# Altium project CCD_CAM_BOARD.PrjPcb (part 4 of 4)

## Sheet P6_CCD_CAM_BOARD_HDMI.SchDoc
size A4
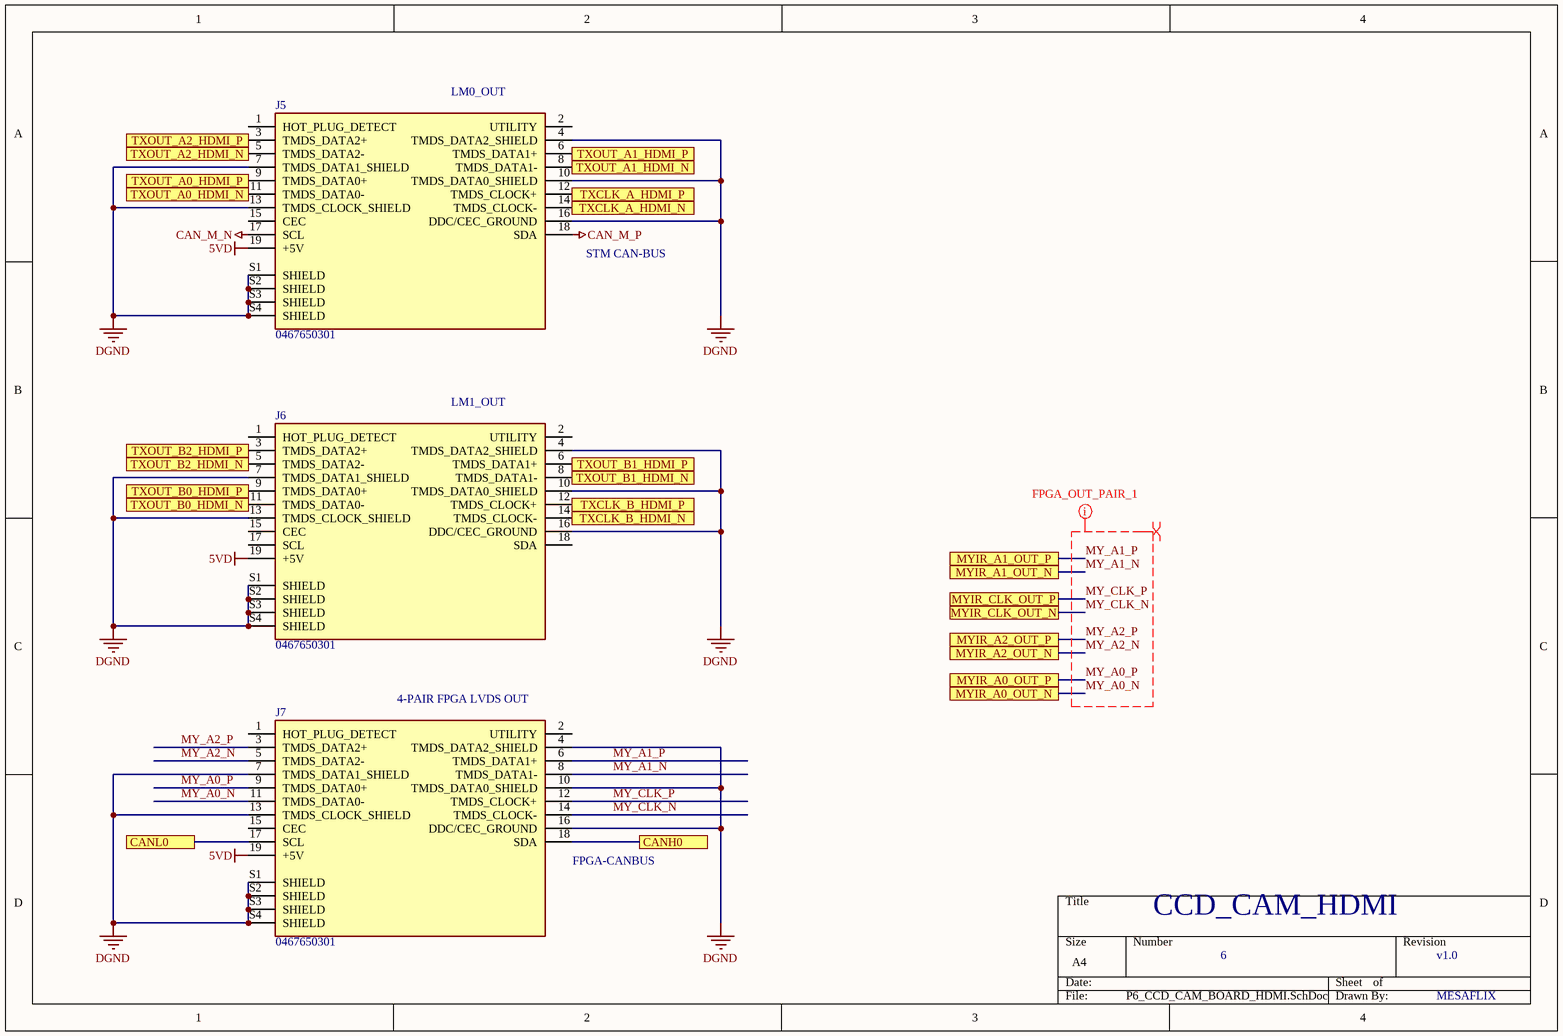
[diagram p5: P6_CCD_CAM_BOARD_HDMI.SchDoc]

### Parts
J5  0467650301  [MOLEX_0467650301]
J6  0467650301  [MOLEX_0467650301]
J7  0467650301  [MOLEX_0467650301]

### Ports
CANH0, CANL0, MYIR_A0_OUT_N, MYIR_A0_OUT_P, MYIR_A1_OUT_N, MYIR_A1_OUT_P, MYIR_A2_OUT_N, MYIR_A2_OUT_P, MYIR_CLK_OUT_N, MYIR_CLK_OUT_P, TXCLK_A_HDMI_N, TXCLK_A_HDMI_P, TXCLK_B_HDMI_N, TXCLK_B_HDMI_P, TXOUT_A0_HDMI_N, TXOUT_A0_HDMI_P, TXOUT_A1_HDMI_N, TXOUT_A1_HDMI_P, TXOUT_A2_HDMI_N, TXOUT_A2_HDMI_P, TXOUT_B0_HDMI_N, TXOUT_B0_HDMI_P, TXOUT_B1_HDMI_N, TXOUT_B1_HDMI_P, TXOUT_B2_HDMI_N, TXOUT_B2_HDMI_P

### Nets
5VD: J5.19(+5V) J6.19(+5V) J7.19(+5V)  [project net VDD_5V]
CAN_M_N: J5.17(SCL)
CAN_M_P: J5.18(SDA)
DGND: J5.4(TMDS_DATA2_SHIELD) J5.7(TMDS_DATA1_SHIELD) J5.10(TMDS_DATA0_SHIELD) J5.13(TMDS_CLOCK_SHIELD) J5.16(DDC/CEC_GROUND) J5.S1(SHIELD) J5.S2(SHIELD) J5.S3(SHIELD) J5.S4(SHIELD) J6.4(TMDS_DATA2_SHIELD) J6.7(TMDS_DATA1_SHIELD) J6.10(TMDS_DATA0_SHIELD) J6.13(TMDS_CLOCK_SHIELD) J6.16(DDC/CEC_GROUND) J6.S1(SHIELD) J6.S2(SHIELD) J6.S3(SHIELD) J6.S4(SHIELD) J7.4(TMDS_DATA2_SHIELD) J7.7(TMDS_DATA1_SHIELD) J7.10(TMDS_DATA0_SHIELD) J7.13(TMDS_CLOCK_SHIELD) J7.16(DDC/CEC_GROUND) J7.S1(SHIELD) J7.S2(SHIELD) J7.S3(SHIELD) J7.S4(SHIELD)
A0_N: J5.11(TMDS_DATA0-) ; port TXOUT_A0_HDMI_N
A0_P: J5.9(TMDS_DATA0+) ; port TXOUT_A0_HDMI_P
A1_N: J5.8(TMDS_DATA1-) ; port TXOUT_A1_HDMI_N
A1_P: J5.6(TMDS_DATA1+) ; port TXOUT_A1_HDMI_P
A2_N: J5.5(TMDS_DATA2-) ; port TXOUT_A2_HDMI_N
A2_P: J5.3(TMDS_DATA2+) ; port TXOUT_A2_HDMI_P
ACK_N: J5.14(TMDS_CLOCK-) ; port TXCLK_A_HDMI_N
ACK_P: J5.12(TMDS_CLOCK+) ; port TXCLK_A_HDMI_P
B0_N: J6.11(TMDS_DATA0-) ; port TXOUT_B0_HDMI_N
B0_P: J6.9(TMDS_DATA0+) ; port TXOUT_B0_HDMI_P
B1_N: J6.8(TMDS_DATA1-) ; port TXOUT_B1_HDMI_N
B1_P: J6.6(TMDS_DATA1+) ; port TXOUT_B1_HDMI_P
B2_N: J6.5(TMDS_DATA2-) ; port TXOUT_B2_HDMI_N
B2_P: J6.3(TMDS_DATA2+) ; port TXOUT_B2_HDMI_P
BCK_N: J6.14(TMDS_CLOCK-) ; port TXCLK_B_HDMI_N
BCK_P: J6.12(TMDS_CLOCK+) ; port TXCLK_B_HDMI_P
CAN_MYIR_N: J7.17(SCL) ; port CANL0
CAN_MYIR_P: J7.18(SDA) ; port CANH0
MY_A0_N: J7.11(TMDS_DATA0-) ; port MYIR_A0_OUT_N
MY_A0_P: J7.9(TMDS_DATA0+) ; port MYIR_A0_OUT_P
MY_A1_N: J7.8(TMDS_DATA1-) ; port MYIR_A1_OUT_N
MY_A1_P: J7.6(TMDS_DATA1+) ; port MYIR_A1_OUT_P
MY_A2_N: J7.5(TMDS_DATA2-) ; port MYIR_A2_OUT_N
MY_A2_P: J7.3(TMDS_DATA2+) ; port MYIR_A2_OUT_P
MY_CLK_N: J7.14(TMDS_CLOCK-) ; port MYIR_CLK_OUT_N
MY_CLK_P: J7.12(TMDS_CLOCK+) ; port MYIR_CLK_OUT_P

Not connected (* = marked no-connect by the designer): J5 1(HOT_PLUG_DETECT) 2(UTILITY) 15(CEC); J6 1(HOT_PLUG_DETECT) 2(UTILITY) 15(CEC) 17(SCL) 18(SDA); J7 1(HOT_PLUG_DETECT) 2(UTILITY) 15(CEC)

### Layout directives
differential pair: MY_A0_N, MY_A0_P, MY_A1_N, MY_A1_P, MY_A2_N, MY_A2_P, MY_CLK_N, MY_CLK_P
mark named FPGA_OUT_PAIR_1: MY_A0_N, MY_A0_P, MY_A1_N, MY_A1_P, MY_A2_N, MY_A2_P, MY_CLK_N, MY_CLK_P

### Notes on the sheet
- (near J5) LM0_OUT
- (near J5) STM CAN-BUS
- (near J6) LM1_OUT
- (near J7) 4-PAIR FPGA LVDS OUT
- (near J7) FPGA-CANBUS
- CCD_CAM_HDMI
- 6
- v1.0
- MESAFLIX

### Library data of the parts
J5-J7 = 0467650301: HDMI - Micro Receptacle Connector 19 Position Surface Mount, Right Angle; MF: Molex; Value: *; Package: None; Price: None; MP: 0467650301; SnapEDA_Link: https://www.snapeda.com/parts/0467650301/Molex/view-part/2155824/?ref=snap; Availability: Unavailable

## Sheet P7_CCD_CAM_BOARD_MYIR.SchDoc
size A3
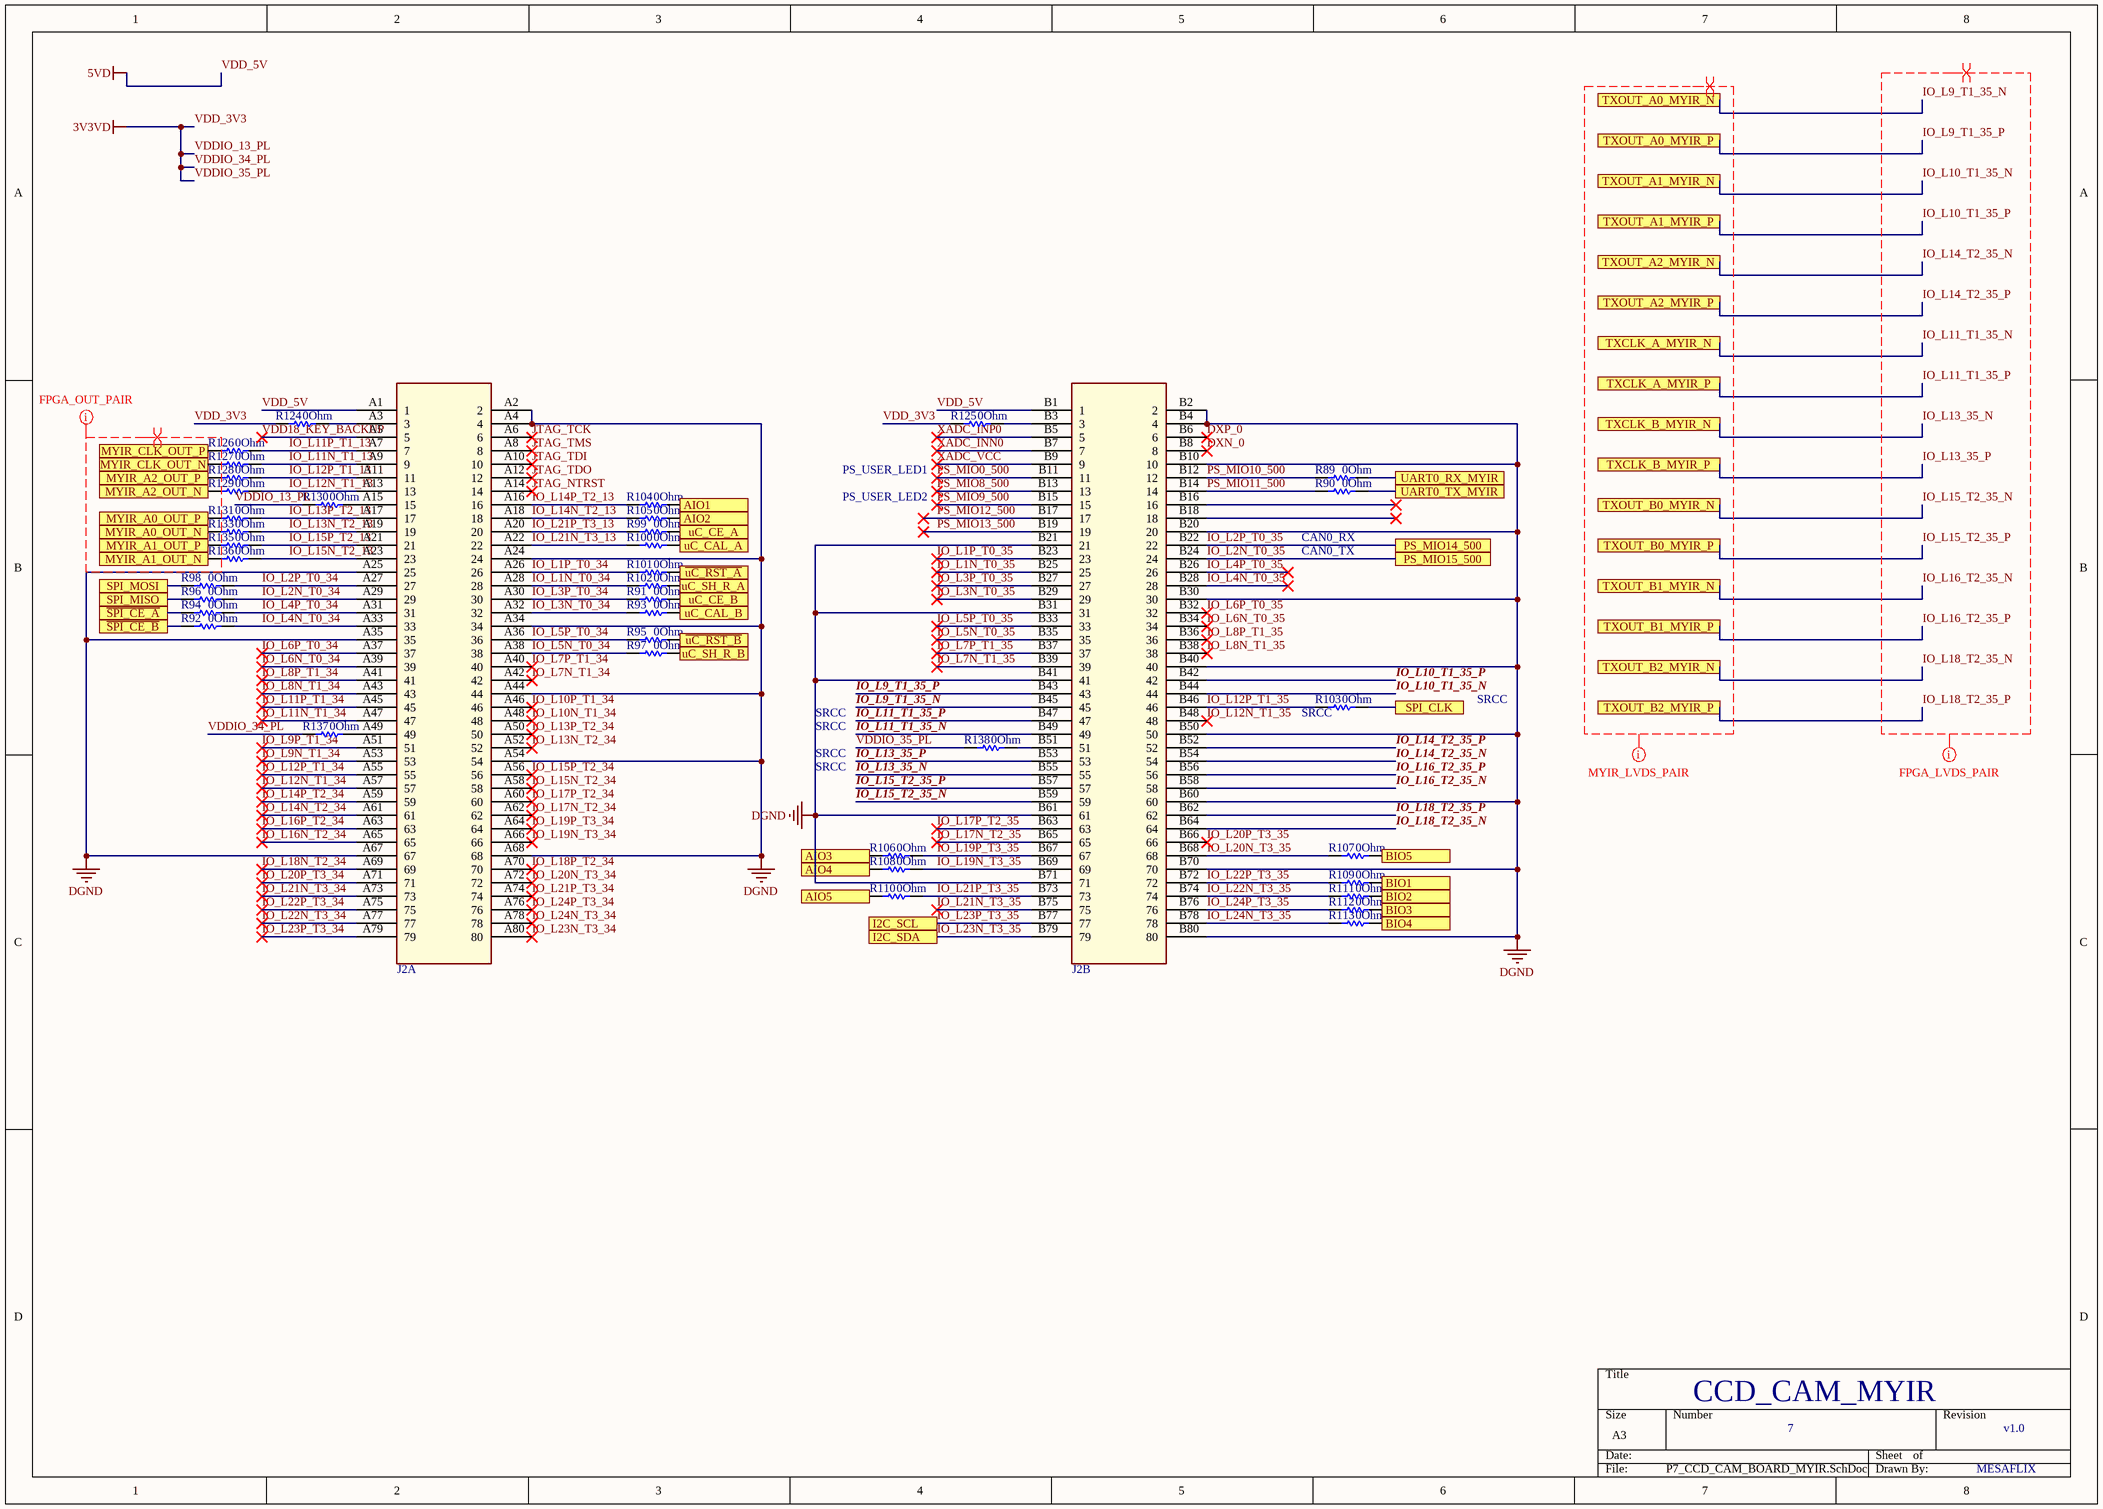
[diagram p6: P7_CCD_CAM_BOARD_MYIR.SchDoc]

### Parts
J2  40x2 Connector 1.27mm Pitch  [CON2x80_MYIR_SMD]  (value not drawn)  (parts A,B of 2)
R89  value 0Ohm  [R 0402(1005)]  (hidden comment: RES_DNP_0603)
R90  value 0Ohm  [R 0402(1005)]  (hidden comment: RES_DNP_0603)
R91  value 0Ohm  [R 0402(1005)]  (hidden comment: RES_DNP_0603)
R92  value 0Ohm  [R 0402(1005)]  (hidden comment: RES_DNP_0603)
R93  value 0Ohm  [R 0402(1005)]  (hidden comment: RES_DNP_0603)
R94  value 0Ohm  [R 0402(1005)]  (hidden comment: RES_DNP_0603)
R95  value 0Ohm  [R 0402(1005)]  (hidden comment: RES_DNP_0603)
R96  value 0Ohm  [R 0402(1005)]  (hidden comment: RES_DNP_0603)
R97  value 0Ohm  [R 0402(1005)]  (hidden comment: RES_DNP_0603)
R98  value 0Ohm  [R 0402(1005)]  (hidden comment: RES_DNP_0603)
R99  value 0Ohm  [R 0402(1005)]  (hidden comment: RES_DNP_0603)
R100  value 0Ohm  [R 0402(1005)]  (hidden comment: RES_DNP_0603)
R101  value 0Ohm  [R 0402(1005)]  (hidden comment: RES_DNP_0603)
R102  value 0Ohm  [R 0402(1005)]  (hidden comment: RES_DNP_0603)
R103  value 0Ohm  [R 0402(1005)]  (hidden comment: RES_DNP_0603)
R104  value 0Ohm  [R 0402(1005)]  (hidden comment: RES_DNP_0603)
R105  value 0Ohm  [R 0402(1005)]  (hidden comment: RES_DNP_0603)
R106  value 0Ohm  [R 0402(1005)]  (hidden comment: RES_DNP_0603)
R107  value 0Ohm  [R 0402(1005)]  (hidden comment: RES_DNP_0603)
R108  value 0Ohm  [R 0402(1005)]  (hidden comment: RES_DNP_0603)
R109  value 0Ohm  [R 0402(1005)]  (hidden comment: RES_DNP_0603)
R110  value 0Ohm  [R 0402(1005)]  (hidden comment: RES_DNP_0603)
R111  value 0Ohm  [R 0402(1005)]  (hidden comment: RES_DNP_0603)
R112  value 0Ohm  [R 0402(1005)]  (hidden comment: RES_DNP_0603)
R113  value 0Ohm  [R 0402(1005)]  (hidden comment: RES_DNP_0603)
R124  value 0Ohm  [R 0402(1005)]  (hidden comment: RES_DNP_0603)
R125  value 0Ohm  [R 0402(1005)]  (hidden comment: RES_DNP_0603)
R126  value 0Ohm  [R 0402(1005)]  (hidden comment: RES_DNP_0603)
R127  value 0Ohm  [R 0402(1005)]  (hidden comment: RES_DNP_0603)
R128  value 0Ohm  [R 0402(1005)]  (hidden comment: RES_DNP_0603)
R129  value 0Ohm  [R 0402(1005)]  (hidden comment: RES_DNP_0603)
R130  value 0Ohm  [R 0402(1005)]  (hidden comment: RES_DNP_0603)
R131  value 0Ohm  [R 0402(1005)]  (hidden comment: RES_DNP_0603)
R133  value 0Ohm  [R 0402(1005)]  (hidden comment: RES_DNP_0603)
R135  value 0Ohm  [R 0402(1005)]  (hidden comment: RES_DNP_0603)
R136  value 0Ohm  [R 0402(1005)]  (hidden comment: RES_DNP_0603)
R137  value 0Ohm  [R 0402(1005)]  (hidden comment: RES_DNP_0603)
R138  value 0Ohm  [R 0402(1005)]  (hidden comment: RES_DNP_0603)

### Ports
AIO1, AIO2, AIO3, AIO4, AIO5, BIO1, BIO2, BIO3, BIO4, BIO5, I2C_SCL, I2C_SDA, MYIR_A0_OUT_N, MYIR_A0_OUT_P, MYIR_A1_OUT_N, MYIR_A1_OUT_P, MYIR_A2_OUT_N, MYIR_A2_OUT_P, MYIR_CLK_OUT_N, MYIR_CLK_OUT_P, PS_MIO14_500, PS_MIO15_500, SPI_CLK, SPI_MISO, SPI_MOSI, TXCLK_A_MYIR_N, TXCLK_A_MYIR_P, TXCLK_B_MYIR_N, TXCLK_B_MYIR_P, TXOUT_A0_MYIR_N, TXOUT_A0_MYIR_P, TXOUT_A1_MYIR_N, TXOUT_A1_MYIR_P, TXOUT_A2_MYIR_N, TXOUT_A2_MYIR_P, TXOUT_B0_MYIR_N, TXOUT_B0_MYIR_P, TXOUT_B1_MYIR_N, TXOUT_B1_MYIR_P, TXOUT_B2_MYIR_N, TXOUT_B2_MYIR_P, UART0_RX_MYIR, UART0_TX_MYIR, uC_CAL_A, uC_CAL_B, uC_CE_A, uC_CE_B, uC_SH_R_A, uC_SH_R_B, ~{SPI_CE_A}, ~{SPI_CE_B}, ~{uC_RST_A}, ~{uC_RST_B}

### Nets
DGND: J2.A2(2) J2.A4(4) J2.A24(24) J2.A25(25) J2.A34(34) J2.A35(35) J2.A44(44) J2.A54(54) J2.A67(67) J2.A68(68) J2.B2(2) J2.B4(4) J2.B10(10) J2.B20(20) J2.B21(21) J2.B30(30) J2.B31(31) J2.B40(40) J2.B41(41) J2.B50(50) J2.B60(60) J2.B61(61) J2.B70(70) J2.B71(71) J2.B80(80)
VDD_3V3: R124.1 R125.1 R130.1 R137.1 R138.1  [also labelled 3V3VD, VDDIO_13_PL, VDDIO_34_PL, VDDIO_35_PL]
VDD_5V: J2.A1(1) J2.B1(1)  [also labelled 5VD]
DXN_0: J2.B8(8)
DXP_0: J2.B6(6)
IO_L1N_T0_34: J2.A28(28) R102.1
IO_L1N_T0_35: J2.B25(25)
IO_L1P_T0_34: J2.A26(26) R101.1
IO_L1P_T0_35: J2.B23(23)
IO_L2N_T0_34: J2.A29(29) R96.2
IO_L2N_T0_35: J2.B24(24) ; port PS_MIO15_500  [project net CAN_MYIR_TX]
IO_L2P_T0_34: J2.A27(27) R98.2
IO_L2P_T0_35: J2.B22(22) ; port PS_MIO14_500  [project net CAN_MYIR_RX]
IO_L3N_T0_34: J2.A32(32) R93.1
IO_L3N_T0_35: J2.B29(29)
IO_L3P_T0_34: J2.A30(30) R91.1
IO_L3P_T0_35: J2.B27(27)
IO_L4N_T0_34: J2.A33(33) R92.2
IO_L4N_T0_35: J2.B28(28)
IO_L4P_T0_34: J2.A31(31) R94.2
IO_L4P_T0_35: J2.B26(26)
IO_L5N_T0_34: J2.A38(38) R97.1
IO_L5N_T0_35: J2.B35(35)
IO_L5P_T0_34: J2.A36(36) R95.1
IO_L5P_T0_35: J2.B33(33)
IO_L6N_T0_34: J2.A39(39)
IO_L6N_T0_35: J2.B34(34)
IO_L6P_T0_34: J2.A37(37)
IO_L6P_T0_35: J2.B32(32)
IO_L7N_T1_34: J2.A42(42)
IO_L7N_T1_35: J2.B39(39)
IO_L7P_T1_34: J2.A40(40)
IO_L7P_T1_35: J2.B37(37)
IO_L8N_T1_34: J2.A43(43)
IO_L8N_T1_35: J2.B38(38)
IO_L8P_T1_34: J2.A41(41)
IO_L8P_T1_35: J2.B36(36)
IO_L9_T1_35_N: J2.B45(45) ; port TXOUT_A0_MYIR_N
IO_L9_T1_35_P: J2.B43(43) ; port TXOUT_A0_MYIR_P
IO_L9N_T1_34: J2.A53(53)
IO_L9P_T1_34: J2.A51(51)
IO_L10_T1_35_N: J2.B44(44) ; port TXOUT_A1_MYIR_N
IO_L10_T1_35_P: J2.B42(42) ; port TXOUT_A1_MYIR_P
IO_L10N_T1_34: J2.A48(48)
IO_L10P_T1_34: J2.A46(46)
IO_L11_T1_35_N: J2.B49(49) ; port TXCLK_A_MYIR_N
IO_L11_T1_35_P: J2.B47(47) ; port TXCLK_A_MYIR_P
IO_L11N_T1_13: J2.A9(9) R127.2
IO_L11N_T1_34: J2.A47(47)
IO_L11P_T1_13: J2.A7(7) R126.2
IO_L11P_T1_34: J2.A45(45)
IO_L12N_T1_13: J2.A13(13) R129.2
IO_L12N_T1_34: J2.A57(57)
IO_L12N_T1_35: J2.B48(48)
IO_L12P_T1_13: J2.A11(11) R128.2
IO_L12P_T1_34: J2.A55(55)
IO_L12P_T1_35: J2.B46(46) R103.1
IO_L13_35_N: J2.B55(55) ; port TXCLK_B_MYIR_N
IO_L13_35_P: J2.B53(53) ; port TXCLK_B_MYIR_P
IO_L13N_T2_13: J2.A19(19) R133.2
IO_L13N_T2_34: J2.A52(52)
IO_L13P_T2_13: J2.A17(17) R131.2
IO_L13P_T2_34: J2.A50(50)
IO_L14_T2_35_N: J2.B54(54) ; port TXOUT_A2_MYIR_N
IO_L14_T2_35_P: J2.B52(52) ; port TXOUT_A2_MYIR_P
IO_L14N_T2_13: J2.A18(18) R105.1
IO_L14N_T2_34: J2.A61(61)
IO_L14P_T2_13: J2.A16(16) R104.1
IO_L14P_T2_34: J2.A59(59)
IO_L15_T2_35_N: J2.B59(59) ; port TXOUT_B0_MYIR_N
IO_L15_T2_35_P: J2.B57(57) ; port TXOUT_B0_MYIR_P
IO_L15N_T2_13: J2.A23(23) R136.2
IO_L15N_T2_34: J2.A58(58)
IO_L15P_T2_13: J2.A21(21) R135.2
IO_L15P_T2_34: J2.A56(56)
IO_L16_T2_35_N: J2.B58(58) ; port TXOUT_B1_MYIR_N
IO_L16_T2_35_P: J2.B56(56) ; port TXOUT_B1_MYIR_P
IO_L16N_T2_34: J2.A65(65)
IO_L16P_T2_34: J2.A63(63)
IO_L17N_T2_34: J2.A62(62)
IO_L17N_T2_35: J2.B65(65)
IO_L17P_T2_34: J2.A60(60)
IO_L17P_T2_35: J2.B63(63)
IO_L18_T2_35_N: J2.B64(64) ; port TXOUT_B2_MYIR_N
IO_L18_T2_35_P: J2.B62(62) ; port TXOUT_B2_MYIR_P
IO_L18N_T2_34: J2.A69(69)
IO_L18P_T2_34: J2.A70(70)
IO_L19N_T3_34: J2.A66(66)
IO_L19N_T3_35: J2.B69(69) R108.2
IO_L19P_T3_34: J2.A64(64)
IO_L19P_T3_35: J2.B67(67) R106.2
IO_L20N_T3_34: J2.A72(72)
IO_L20N_T3_35: J2.B68(68) R107.1
IO_L20P_T3_34: J2.A71(71)
IO_L20P_T3_35: J2.B66(66)
IO_L21N_T3_13: J2.A22(22) R100.1
IO_L21N_T3_34: J2.A73(73)
IO_L21N_T3_35: J2.B75(75)
IO_L21P_T3_13: J2.A20(20) R99.1
IO_L21P_T3_34: J2.A74(74)
IO_L21P_T3_35: J2.B73(73) R110.2
IO_L22N_T3_34: J2.A77(77)
IO_L22N_T3_35: J2.B74(74) R111.1
IO_L22P_T3_34: J2.A75(75)
IO_L22P_T3_35: J2.B72(72) R109.1
IO_L23N_T3_34: J2.A80(80)
IO_L23N_T3_35: J2.B79(79) ; port I2C_SDA  [project net I2C1_SDA]
IO_L23P_T3_34: J2.A79(79)
IO_L23P_T3_35: J2.B77(77) ; port I2C_SCL  [project net I2C1_SCL]
IO_L24N_T3_34: J2.A78(78)
IO_L24N_T3_35: J2.B78(78) R113.1
IO_L24P_T3_34: J2.A76(76)
IO_L24P_T3_35: J2.B76(76) R112.1
JTAG_NTRST: J2.A14(14)
JTAG_TCK: J2.A6(6)
JTAG_TDI: J2.A10(10)
JTAG_TDO: J2.A12(12)
JTAG_TMS: J2.A8(8)
MY_A0_N: R133.1 ; port MYIR_A0_OUT_N
MY_A0_P: R131.1 ; port MYIR_A0_OUT_P
MY_A1_N: R136.1 ; port MYIR_A1_OUT_N
MY_A1_P: R135.1 ; port MYIR_A1_OUT_P
MY_A2_N: R129.1 ; port MYIR_A2_OUT_N
MY_A2_P: R128.1 ; port MYIR_A2_OUT_P
MY_CLK_N: R127.1 ; port MYIR_CLK_OUT_N
MY_CLK_P: R126.1 ; port MYIR_CLK_OUT_P
PS_MIO0_500: J2.B11(11)
PS_MIO8_500: J2.B13(13)
PS_MIO9_500: J2.B15(15)
PS_MIO10_500: J2.B12(12) R89.1
PS_MIO11_500: J2.B14(14) R90.1
PS_MIO12_500: J2.B17(17)
PS_MIO13_500: J2.B19(19)
USART2_RX: R90.2 ; port UART0_TX_MYIR
USART2_TX: R89.2 ; port UART0_RX_MYIR
VDD18_KEY_BACKUP: J2.A5(5)
XADC_INN0: J2.B7(7)
XADC_INP0: J2.B5(5)
XADC_VCC: J2.B9(9)
NetJ2_A3: J2.A3(3) R124.2
NetJ2_A15: J2.A15(15) R130.2
NetJ2_A49: J2.A49(49) R137.2
NetJ2_B3: J2.B3(3) R125.2
NetJ2_B51: J2.B51(51) R138.2
NetR21_1: R94.1 ; port ~{SPI_CE_A}
NetR22_1: R103.2 ; port SPI_CLK
NetR23_1: R96.1 ; port SPI_MISO
NetR24_1: R98.1 ; port SPI_MOSI
NetR27_2: R102.2 ; port uC_SH_R_A
NetR28_2: R101.2 ; port ~{uC_RST_A}
NetR29_1: R91.2 ; port uC_CE_B
NetR30_2: R100.2 ; port uC_CAL_A
NetR31_2: R99.2 ; port uC_CE_A
NetR33_2: R92.1 ; port ~{SPI_CE_B}
NetR34_2: R97.2 ; port uC_SH_R_B
NetR35_2: R95.2 ; port ~{uC_RST_B}
NetR36_2: R93.2 ; port uC_CAL_B
NetR104_2: R104.2 ; port AIO1
NetR105_2: R105.2 ; port AIO2
NetR106_1: R106.1 ; port AIO3
NetR107_2: R107.2 ; port BIO5
NetR108_1: R108.1 ; port AIO4
NetR109_2: R109.2 ; port BIO1
NetR110_1: R110.1 ; port AIO5
NetR111_2: R111.2 ; port BIO2
NetR112_2: R112.2 ; port BIO3
NetR113_2: R113.2 ; port BIO4

Not connected (* = marked no-connect by the designer): J2 B16(16)* B18(18)*

### Layout directives
mark named FPGA_LVDS_PAIR: IO_L9_T1_35_N, IO_L9_T1_35_P, IO_L10_T1_35_N, IO_L10_T1_35_P, IO_L11_T1_35_N, IO_L11_T1_35_P, IO_L13_35_N, IO_L13_35_P, IO_L14_T2_35_N, IO_L14_T2_35_P, IO_L15_T2_35_N, IO_L15_T2_35_P, IO_L16_T2_35_N, IO_L16_T2_35_P, IO_L18_T2_35_N, IO_L18_T2_35_P
mark named MYIR_LVDS_PAIR: (no net found under the mark)
mark named FPGA_OUT_PAIR: (no net found under the mark)
differential pair: (no net found under the mark), IO_L9_T1_35_N, IO_L9_T1_35_P, IO_L10_T1_35_N, IO_L10_T1_35_P, IO_L11_T1_35_N, IO_L11_T1_35_P, IO_L13_35_N, IO_L13_35_P, IO_L14_T2_35_N, IO_L14_T2_35_P, IO_L15_T2_35_N, IO_L15_T2_35_P, IO_L16_T2_35_N, IO_L16_T2_35_P, IO_L18_T2_35_N, IO_L18_T2_35_P

### Notes on the sheet
- PS_USER_LED1
- PS_USER_LED2
- CAN0_RX
- CAN0_TX
- SRCC
- (near R103) SRCC
- CCD_CAM_MYIR
- 7
- v1.0
- MESAFLIX

### Library data of the parts
J2 = CON_40x2_MYIR_ZTURN: Manufacturer Part Number: 20021121-00080T4LF; Digikey Part Number: 609-3741-ND
R89-R113 R124-R131 R133 R135-R138 = RES_1K_0603: Manufacturer: Yageo; ManufacturerPartNumber: AC0603FR-070RL; DetailedDesctiprition: 0 Ohms Jumper 0.1W, 1/10W Chip Resistor 0603 (1608 Metric) Automotive AEC-Q200, Moisture Resistant Thick Film; DigikeyPartNumber: 311-0.0LDCT-ND

## Nets that join several sheets
2V5VC: P2_CCD_CAM_BOARD_POWER (C44.1 FB8.2), P5_CCD_CAM_BOARD_AFE (U14.5 U15.5 U16.5 U17.5)
3V3VA: P2_CCD_CAM_BOARD_POWER (C34.1 FB5.1), P5_CCD_CAM_BOARD_AFE (16 pins)
3V3VC: P2_CCD_CAM_BOARD_POWER (C27.1 FB2.2), P5_CCD_CAM_BOARD_AFE (8 pins)
10V: P3_CCD_CAM_BOARD_CAMERA (16 pins), P2_CCD_CAM_BOARD_POWER (6 pins)
AGND: P3_CCD_CAM_BOARD_CAMERA (12 pins), P2_CCD_CAM_BOARD_POWER (C34.2 FB3.1), P5_CCD_CAM_BOARD_AFE (28 pins)
CAN_M_N: P8_CCD_CAM_BOARD_COMM (5 pins), P6_CCD_CAM_BOARD_HDMI (J5.17)
CAN_M_P: P8_CCD_CAM_BOARD_COMM (5 pins), P6_CCD_CAM_BOARD_HDMI (J5.18)
CAN_MCU_N: P4_CCD_CAM_BOARD_MCU (U7.61), P8_CCD_CAM_BOARD_COMM (U21.4)
CAN_MCU_P: P4_CCD_CAM_BOARD_MCU (U7.62), P8_CCD_CAM_BOARD_COMM (U21.1)
DGND: P3_CCD_CAM_BOARD_CAMERA (10 pins), P2_CCD_CAM_BOARD_POWER (5 pins), P4_CCD_CAM_BOARD_MCU (22 pins), P8_CCD_CAM_BOARD_COMM (19 pins), P5_CCD_CAM_BOARD_AFE (32 pins), P6_CCD_CAM_BOARD_HDMI (27 pins), P7_CCD_CAM_BOARD_MYIR (25 pins)
USB_N: P4_CCD_CAM_BOARD_MCU (U7.44), P8_CCD_CAM_BOARD_COMM (C92.1 R84.2)
USB_P: P4_CCD_CAM_BOARD_MCU (U7.45), P8_CCD_CAM_BOARD_COMM (C93.1 R83.2 R85.1)
VDD_3V3: P3_CCD_CAM_BOARD_CAMERA (C9.2 C10.2 U2.14 U6.14), P2_CCD_CAM_BOARD_POWER (C33.1 FB6.2), P4_CCD_CAM_BOARD_MCU (19 pins), P8_CCD_CAM_BOARD_COMM (FB9.1 FB13.1 R85.2), P5_CCD_CAM_BOARD_AFE (8 pins), P7_CCD_CAM_BOARD_MYIR (5 pins)
VDD_5V: P2_CCD_CAM_BOARD_POWER (C39.1 FB7.2), P6_CCD_CAM_BOARD_HDMI (J5.19 J6.19 J7.19), P7_CCD_CAM_BOARD_MYIR (J2.A1 J2.B1)
VIN_3V3: P2_CCD_CAM_BOARD_POWER (6 pins), P8_CCD_CAM_BOARD_COMM (D9.C)
A0_N: P5_CCD_CAM_BOARD_AFE (R55.1 U14.10), P6_CCD_CAM_BOARD_HDMI (J5.11)
A0_P: P5_CCD_CAM_BOARD_AFE (R55.2 U14.9), P6_CCD_CAM_BOARD_HDMI (J5.9)
A1_N: P5_CCD_CAM_BOARD_AFE (R56.1 U14.14), P6_CCD_CAM_BOARD_HDMI (J5.8)
A1_P: P5_CCD_CAM_BOARD_AFE (R56.2 U14.13), P6_CCD_CAM_BOARD_HDMI (J5.6)
A2_N: P5_CCD_CAM_BOARD_AFE (R67.1 U16.10), P6_CCD_CAM_BOARD_HDMI (J5.5)
A2_P: P5_CCD_CAM_BOARD_AFE (R67.2 U16.9), P6_CCD_CAM_BOARD_HDMI (J5.3)
ACK_N: P5_CCD_CAM_BOARD_AFE (R68.1 U16.14), P6_CCD_CAM_BOARD_HDMI (J5.14)
ACK_P: P5_CCD_CAM_BOARD_AFE (R68.2 U16.13), P6_CCD_CAM_BOARD_HDMI (J5.12)
B0_N: P5_CCD_CAM_BOARD_AFE (R57.1 U15.10), P6_CCD_CAM_BOARD_HDMI (J6.11)
B0_P: P5_CCD_CAM_BOARD_AFE (R57.2 U15.9), P6_CCD_CAM_BOARD_HDMI (J6.9)
B1_N: P5_CCD_CAM_BOARD_AFE (R58.1 U15.14), P6_CCD_CAM_BOARD_HDMI (J6.8)
B1_P: P5_CCD_CAM_BOARD_AFE (R58.2 U15.13), P6_CCD_CAM_BOARD_HDMI (J6.6)
B2_N: P5_CCD_CAM_BOARD_AFE (R69.1 U17.10), P6_CCD_CAM_BOARD_HDMI (J6.5)
B2_P: P5_CCD_CAM_BOARD_AFE (R69.2 U17.9), P6_CCD_CAM_BOARD_HDMI (J6.3)
BCK_N: P5_CCD_CAM_BOARD_AFE (R70.1 U17.14), P6_CCD_CAM_BOARD_HDMI (J6.14)
BCK_P: P5_CCD_CAM_BOARD_AFE (R70.2 U17.13), P6_CCD_CAM_BOARD_HDMI (J6.12)
CAN_MYIR_N: P8_CCD_CAM_BOARD_COMM (5 pins), P6_CCD_CAM_BOARD_HDMI (J7.17)
CAN_MYIR_P: P8_CCD_CAM_BOARD_COMM (5 pins), P6_CCD_CAM_BOARD_HDMI (J7.18)
CAN_MYIR_RX: P8_CCD_CAM_BOARD_COMM (U18.4), P7_CCD_CAM_BOARD_MYIR (J2.B22)
CAN_MYIR_TX: P8_CCD_CAM_BOARD_COMM (U18.1), P7_CCD_CAM_BOARD_MYIR (J2.B24)
CP: P3_CCD_CAM_BOARD_CAMERA (U2.13), P5_CCD_CAM_BOARD_AFE (U12.48 U13.48)
I2C1_SCL: P4_CCD_CAM_BOARD_MCU (J4.5 R139.2 U7.58), P7_CCD_CAM_BOARD_MYIR (J2.B77)
I2C1_SDA: P4_CCD_CAM_BOARD_MCU (J4.7 R140.2 U7.59), P7_CCD_CAM_BOARD_MYIR (J2.B79)
IO_L9_T1_35_N: P5_CCD_CAM_BOARD_AFE (R63.2 U14.12), P7_CCD_CAM_BOARD_MYIR (J2.B45)
IO_L9_T1_35_P: P5_CCD_CAM_BOARD_AFE (R63.1 U14.11), P7_CCD_CAM_BOARD_MYIR (J2.B43)
IO_L10_T1_35_N: P5_CCD_CAM_BOARD_AFE (R64.2 U14.16), P7_CCD_CAM_BOARD_MYIR (J2.B44)
IO_L10_T1_35_P: P5_CCD_CAM_BOARD_AFE (R64.1 U14.15), P7_CCD_CAM_BOARD_MYIR (J2.B42)
IO_L11_T1_35_N: P5_CCD_CAM_BOARD_AFE (R76.2 U16.16), P7_CCD_CAM_BOARD_MYIR (J2.B49)
IO_L11_T1_35_P: P5_CCD_CAM_BOARD_AFE (R76.1 U16.15), P7_CCD_CAM_BOARD_MYIR (J2.B47)
IO_L13_35_N: P5_CCD_CAM_BOARD_AFE (R78.2 U17.16), P7_CCD_CAM_BOARD_MYIR (J2.B55)
IO_L13_35_P: P5_CCD_CAM_BOARD_AFE (R78.1 U17.15), P7_CCD_CAM_BOARD_MYIR (J2.B53)
IO_L14_T2_35_N: P5_CCD_CAM_BOARD_AFE (R75.2 U16.12), P7_CCD_CAM_BOARD_MYIR (J2.B54)
IO_L14_T2_35_P: P5_CCD_CAM_BOARD_AFE (R75.1 U16.11), P7_CCD_CAM_BOARD_MYIR (J2.B52)
IO_L15_T2_35_N: P5_CCD_CAM_BOARD_AFE (R65.2 U15.12), P7_CCD_CAM_BOARD_MYIR (J2.B59)
IO_L15_T2_35_P: P5_CCD_CAM_BOARD_AFE (R65.1 U15.11), P7_CCD_CAM_BOARD_MYIR (J2.B57)
IO_L16_T2_35_N: P5_CCD_CAM_BOARD_AFE (R66.2 U15.16), P7_CCD_CAM_BOARD_MYIR (J2.B58)
IO_L16_T2_35_P: P5_CCD_CAM_BOARD_AFE (R66.1 U15.15), P7_CCD_CAM_BOARD_MYIR (J2.B56)
IO_L18_T2_35_N: P5_CCD_CAM_BOARD_AFE (R77.2 U17.12), P7_CCD_CAM_BOARD_MYIR (J2.B64)
IO_L18_T2_35_P: P5_CCD_CAM_BOARD_AFE (R77.1 U17.11), P7_CCD_CAM_BOARD_MYIR (J2.B62)
MY_A0_N: P6_CCD_CAM_BOARD_HDMI (J7.11), P7_CCD_CAM_BOARD_MYIR (R133.1)
MY_A0_P: P6_CCD_CAM_BOARD_HDMI (J7.9), P7_CCD_CAM_BOARD_MYIR (R131.1)
MY_A1_N: P6_CCD_CAM_BOARD_HDMI (J7.8), P7_CCD_CAM_BOARD_MYIR (R136.1)
MY_A1_P: P6_CCD_CAM_BOARD_HDMI (J7.6), P7_CCD_CAM_BOARD_MYIR (R135.1)
MY_A2_N: P6_CCD_CAM_BOARD_HDMI (J7.5), P7_CCD_CAM_BOARD_MYIR (R129.1)
MY_A2_P: P6_CCD_CAM_BOARD_HDMI (J7.3), P7_CCD_CAM_BOARD_MYIR (R128.1)
MY_CLK_N: P6_CCD_CAM_BOARD_HDMI (J7.14), P7_CCD_CAM_BOARD_MYIR (R127.1)
MY_CLK_P: P6_CCD_CAM_BOARD_HDMI (J7.12), P7_CCD_CAM_BOARD_MYIR (R126.1)
NetJ8_10: P3_CCD_CAM_BOARD_CAMERA (J8.10), P5_CCD_CAM_BOARD_AFE (U12.46 U13.46)
NetJ8_11: P3_CCD_CAM_BOARD_CAMERA (J8.11), P5_CCD_CAM_BOARD_AFE (U12.45 U13.45)
NetR21_1: P4_CCD_CAM_BOARD_MCU (R21.1), P5_CCD_CAM_BOARD_AFE (U13.11), P7_CCD_CAM_BOARD_MYIR (R94.1)
NetR22_1: P4_CCD_CAM_BOARD_MCU (R22.1), P5_CCD_CAM_BOARD_AFE (U12.10 U13.10), P7_CCD_CAM_BOARD_MYIR (R103.2)
NetR23_1: P4_CCD_CAM_BOARD_MCU (R23.1), P5_CCD_CAM_BOARD_AFE (U12.9 U13.9), P7_CCD_CAM_BOARD_MYIR (R96.1)
NetR24_1: P4_CCD_CAM_BOARD_MCU (R24.1), P5_CCD_CAM_BOARD_AFE (U12.8 U13.8), P7_CCD_CAM_BOARD_MYIR (R98.1)
NetR27_2: P4_CCD_CAM_BOARD_MCU (R27.2), P5_CCD_CAM_BOARD_AFE (U13.7), P7_CCD_CAM_BOARD_MYIR (R102.2)
NetR28_2: P4_CCD_CAM_BOARD_MCU (R28.2), P5_CCD_CAM_BOARD_AFE (U13.6), P7_CCD_CAM_BOARD_MYIR (R101.2)
NetR29_1: P4_CCD_CAM_BOARD_MCU (R29.1), P5_CCD_CAM_BOARD_AFE (U12.4), P7_CCD_CAM_BOARD_MYIR (R91.2)
NetR30_2: P4_CCD_CAM_BOARD_MCU (R30.2), P5_CCD_CAM_BOARD_AFE (U13.5), P7_CCD_CAM_BOARD_MYIR (R100.2)
NetR31_2: P4_CCD_CAM_BOARD_MCU (R31.2), P5_CCD_CAM_BOARD_AFE (U13.4), P7_CCD_CAM_BOARD_MYIR (R99.2)
NetR33_2: P4_CCD_CAM_BOARD_MCU (R33.2), P5_CCD_CAM_BOARD_AFE (U12.11), P7_CCD_CAM_BOARD_MYIR (R92.1)
NetR34_2: P4_CCD_CAM_BOARD_MCU (R34.2), P5_CCD_CAM_BOARD_AFE (U12.7), P7_CCD_CAM_BOARD_MYIR (R97.2)
NetR35_2: P4_CCD_CAM_BOARD_MCU (R35.2), P5_CCD_CAM_BOARD_AFE (U12.6), P7_CCD_CAM_BOARD_MYIR (R95.2)
NetR36_2: P4_CCD_CAM_BOARD_MCU (R36.2), P5_CCD_CAM_BOARD_AFE (U12.5), P7_CCD_CAM_BOARD_MYIR (R93.2)
NetR104_2: P4_CCD_CAM_BOARD_MCU (R115.2), P5_CCD_CAM_BOARD_AFE (U13.1), P7_CCD_CAM_BOARD_MYIR (R104.2)
NetR105_2: P4_CCD_CAM_BOARD_MCU (R114.2), P5_CCD_CAM_BOARD_AFE (U13.2), P7_CCD_CAM_BOARD_MYIR (R105.2)
NetR106_1: P4_CCD_CAM_BOARD_MCU (R116.2), P5_CCD_CAM_BOARD_AFE (U13.56), P7_CCD_CAM_BOARD_MYIR (R106.1)
NetR107_2: P4_CCD_CAM_BOARD_MCU (R123.2), P5_CCD_CAM_BOARD_AFE (U12.53), P7_CCD_CAM_BOARD_MYIR (R107.2)
NetR108_1: P4_CCD_CAM_BOARD_MCU (R117.2), P5_CCD_CAM_BOARD_AFE (U13.55), P7_CCD_CAM_BOARD_MYIR (R108.1)
NetR109_2: P4_CCD_CAM_BOARD_MCU (R122.2), P5_CCD_CAM_BOARD_AFE (U12.1), P7_CCD_CAM_BOARD_MYIR (R109.2)
NetR110_1: P4_CCD_CAM_BOARD_MCU (R118.2), P5_CCD_CAM_BOARD_AFE (U13.53), P7_CCD_CAM_BOARD_MYIR (R110.1)
NetR111_2: P4_CCD_CAM_BOARD_MCU (R121.2), P5_CCD_CAM_BOARD_AFE (U12.2), P7_CCD_CAM_BOARD_MYIR (R111.2)
NetR112_2: P4_CCD_CAM_BOARD_MCU (R120.2), P5_CCD_CAM_BOARD_AFE (U12.56), P7_CCD_CAM_BOARD_MYIR (R112.2)
NetR113_2: P4_CCD_CAM_BOARD_MCU (R119.2), P5_CCD_CAM_BOARD_AFE (U12.55), P7_CCD_CAM_BOARD_MYIR (R113.2)
o1A1-2: P3_CCD_CAM_BOARD_CAMERA (U6.1 U6.3), P5_CCD_CAM_BOARD_AFE (U12.49 U13.49)
o2A1-2: P3_CCD_CAM_BOARD_CAMERA (U6.9 U6.11), P5_CCD_CAM_BOARD_AFE (U12.50 U13.50)
o2B: P3_CCD_CAM_BOARD_CAMERA (U2.9), P5_CCD_CAM_BOARD_AFE (U12.54 U13.54)
OS1_CON: P3_CCD_CAM_BOARD_CAMERA (R13.1 U3.2), P5_CCD_CAM_BOARD_AFE (C73.2)
OS2_CON: P3_CCD_CAM_BOARD_CAMERA (R14.2 U3.5), P5_CCD_CAM_BOARD_AFE (C71.2)
OS3_CON: P3_CCD_CAM_BOARD_CAMERA (R8.1 U1.2), P5_CCD_CAM_BOARD_AFE (C69.2)
OS4_CON: P3_CCD_CAM_BOARD_CAMERA (R9.2 U1.5), P5_CCD_CAM_BOARD_AFE (C70.2)
OS5_CON: P3_CCD_CAM_BOARD_CAMERA (R18.2 U5.5), P5_CCD_CAM_BOARD_AFE (C67.2)
OS6_CON: P3_CCD_CAM_BOARD_CAMERA (R17.1 U5.2), P5_CCD_CAM_BOARD_AFE (C68.2)
RS: P3_CCD_CAM_BOARD_CAMERA (U2.11), P5_CCD_CAM_BOARD_AFE (U12.47 U13.47)
SH1: P3_CCD_CAM_BOARD_CAMERA (J8.13), P5_CCD_CAM_BOARD_AFE (U12.3 U13.3)
USART2_RX: P4_CCD_CAM_BOARD_MCU (U7.17), P7_CCD_CAM_BOARD_MYIR (R90.2)
USART2_TX: P4_CCD_CAM_BOARD_MCU (U7.16), P7_CCD_CAM_BOARD_MYIR (R89.2)